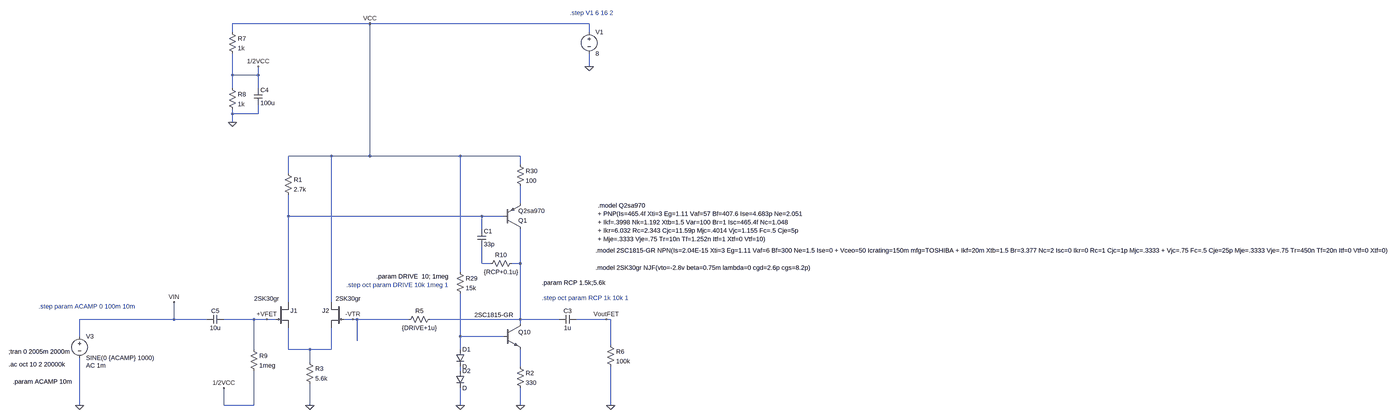
[diagram p0: schematic Discrete_OP_GainUp2.asc, whole sheet]
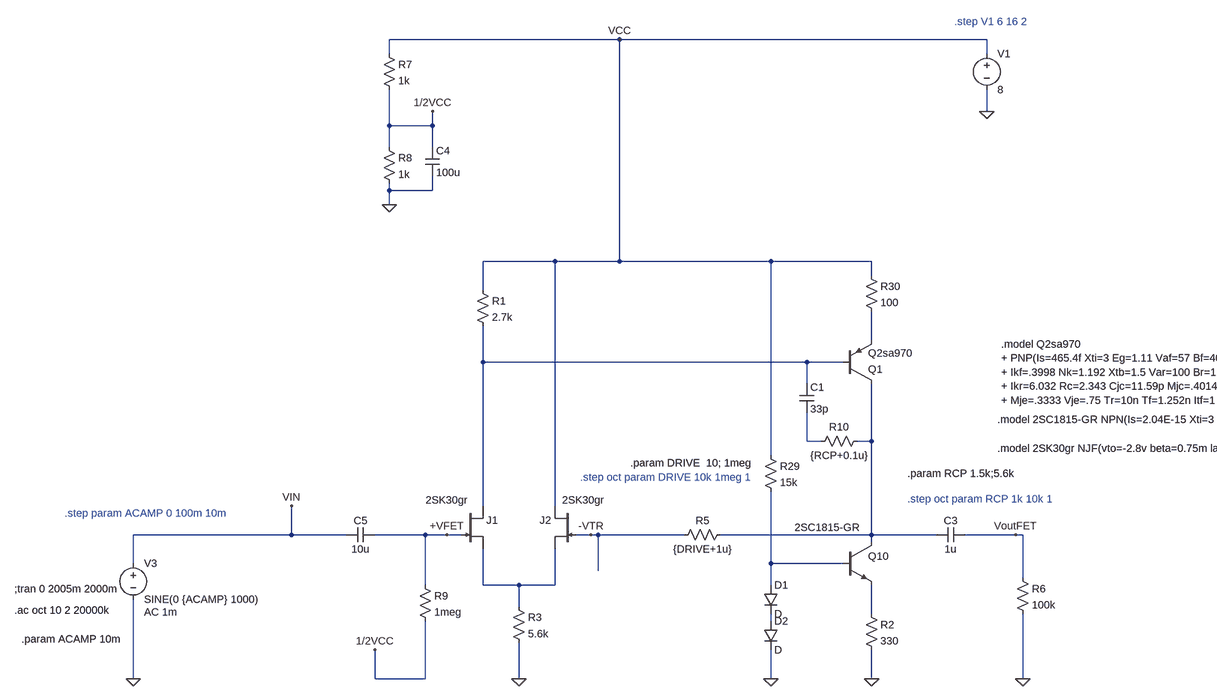
[diagram p1: schematic Discrete_OP_GainUp2.asc, part, row 1 of 1, column 1 of 2]
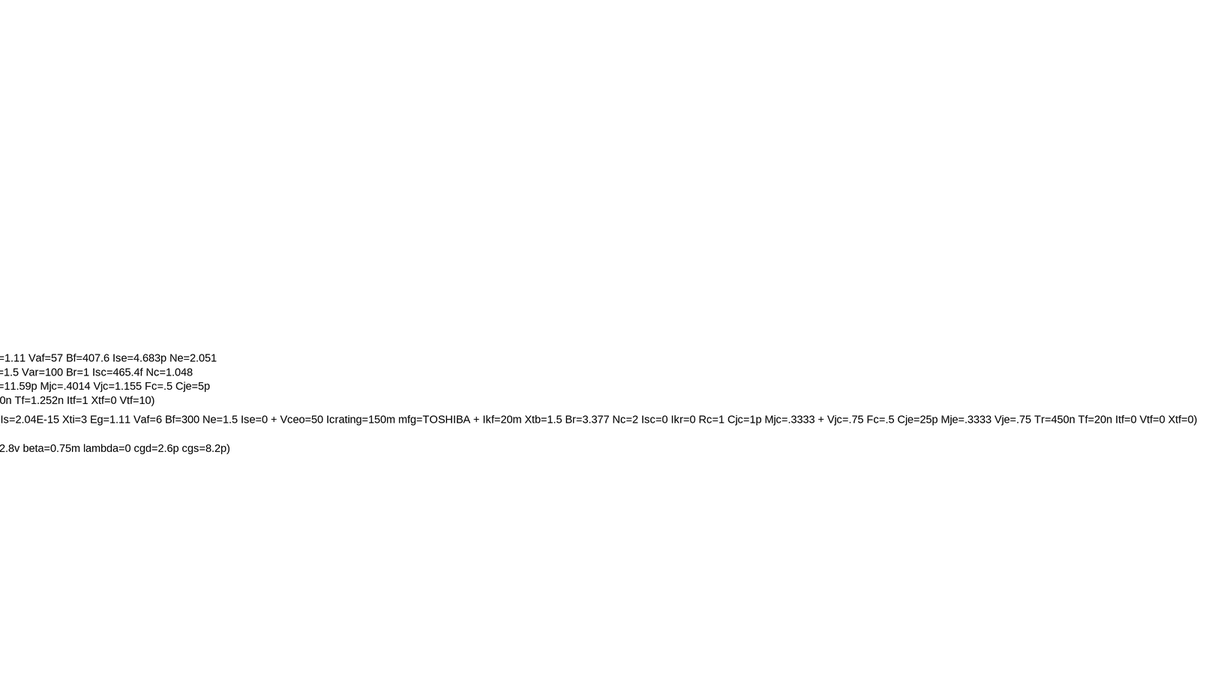
[diagram p2: schematic Discrete_OP_GainUp2.asc, part, row 1 of 1, column 2 of 2]
Discrete_OP_GainUp2.asc, the LTspice schematic file:
Version 4
SHEET 1 4864 4708
WIRE 608 -1136 96 -1136
WIRE 1424 -1136 608 -1136
WIRE 96 -1104 96 -1136
WIRE 1424 -1104 1424 -1136
WIRE 1424 -976 1424 -1024
WIRE 96 -944 96 -1024
WIRE 192 -944 192 -976
WIRE 192 -944 96 -944
WIRE 96 -896 96 -944
WIRE 192 -896 192 -944
WIRE 96 -800 96 -816
WIRE 192 -800 192 -832
WIRE 192 -800 96 -800
WIRE 96 -768 96 -800
WIRE 464 -624 304 -624
WIRE 608 -624 608 -1136
WIRE 608 -624 464 -624
WIRE 944 -624 608 -624
WIRE 1168 -624 944 -624
WIRE 1168 -592 1168 -624
WIRE 304 -560 304 -624
WIRE 1168 -448 1168 -512
WIRE 304 -400 304 -480
WIRE 1024 -400 304 -400
WIRE 1104 -400 1024 -400
WIRE 1024 -352 1024 -400
WIRE 1024 -224 1024 -288
WIRE 1056 -224 1024 -224
WIRE 1168 -224 1168 -352
WIRE 1168 -224 1136 -224
WIRE 944 -192 944 -624
WIRE 304 -80 304 -400
WIRE 464 -80 464 -624
WIRE -208 -16 -208 -80
WIRE -208 -16 -560 -16
WIRE 0 -16 -208 -16
WIRE 176 -16 64 -16
WIRE 224 -16 176 -16
WIRE 256 -16 224 -16
WIRE 544 -16 512 -16
WIRE 560 -16 544 -16
WIRE 752 -16 560 -16
WIRE 1168 -16 1168 -224
WIRE 1168 -16 832 -16
WIRE 1312 -16 1168 -16
WIRE 1488 -16 1376 -16
WIRE 1504 -16 1488 -16
WIRE 1168 0 1168 -16
WIRE -560 48 -560 -16
WIRE 944 48 944 -112
WIRE 1104 48 944 48
WIRE 560 64 560 -16
WIRE 1504 80 1504 -16
WIRE 176 96 176 -16
WIRE 304 96 304 16
WIRE 384 96 304 96
WIRE 464 96 464 16
WIRE 464 96 384 96
WIRE 944 96 944 48
WIRE 384 144 384 96
WIRE 1168 160 1168 96
WIRE 944 176 944 160
WIRE -560 304 -560 128
WIRE 64 304 64 240
WIRE 176 304 176 176
WIRE 176 304 64 304
WIRE 384 304 384 224
WIRE 944 304 944 240
WIRE 1168 304 1168 240
WIRE 1504 304 1504 160
FLAG -560 304 0
FLAG 384 304 0
FLAG 1168 304 0
FLAG 1504 304 0
FLAG 1424 -976 0
FLAG 1488 -16 VoutFET
FLAG 224 -16 +VFET
FLAG 608 -1136 VCC
FLAG 96 -768 0
FLAG 192 -976 1/2VCC
FLAG 64 240 1/2VCC
FLAG -208 -80 VIN
FLAG 544 -16 -VTR
FLAG 944 304 0
SYMBOL njf 256 -80 R0
WINDOW 3 -79 -13 Left 2
SYMATTR Value 2SK30gr
SYMATTR InstName J1
SYMBOL njf 512 -80 M0
WINDOW 3 -62 -13 Left 2
SYMATTR Value 2SK30gr
SYMATTR InstName J2
SYMBOL pnp 1104 -352 M180
SYMATTR InstName Q1
SYMATTR Value Q2sa970
SYMBOL res 288 -576 R0
SYMATTR InstName R1
SYMATTR Value 2.7k
SYMBOL res 1152 144 R0
SYMATTR InstName R2
SYMATTR Value 330
SYMBOL res 368 128 R0
SYMATTR InstName R3
SYMATTR Value 5.6k
SYMBOL voltage 1424 -1120 R0
WINDOW 123 0 0 Left 2
WINDOW 39 0 0 Left 2
SYMATTR InstName V1
SYMATTR Value 8
SYMBOL voltage -560 32 R0
WINDOW 123 24 124 Left 2
WINDOW 39 0 0 Left 2
SYMATTR Value2 AC 1m
SYMATTR InstName V3
SYMATTR Value SINE(0 {ACAMP} 1000)
SYMBOL res 1488 64 R0
SYMATTR InstName R6
SYMATTR Value 100k
SYMBOL cap 1376 -32 R90
WINDOW 0 0 32 VBottom 2
WINDOW 3 32 32 VTop 2
SYMATTR InstName C3
SYMATTR Value 1u
SYMBOL res 80 -1120 R0
SYMATTR InstName R7
SYMATTR Value 1k
SYMBOL res 80 -912 R0
SYMATTR InstName R8
SYMATTR Value 1k
SYMBOL cap 176 -896 R0
SYMATTR InstName C4
SYMATTR Value 100u
SYMBOL res 160 80 R0
SYMATTR InstName R9
SYMATTR Value 1meg
SYMBOL cap 64 -32 R90
WINDOW 0 0 32 VBottom 2
WINDOW 3 32 32 VTop 2
SYMATTR InstName C5
SYMATTR Value 10u
SYMBOL res 848 -32 R90
WINDOW 0 0 56 VBottom 2
WINDOW 3 32 56 VTop 2
SYMATTR InstName R5
SYMATTR Value {DRIVE+1u}
SYMBOL npn 1104 0 R0
WINDOW 3 -107 -32 Left 2
SYMATTR Value 2SC1815-GR
SYMATTR InstName Q10
SYMBOL diode 928 96 R0
SYMATTR InstName D1
SYMBOL diode 928 176 R0
SYMATTR InstName D2
SYMBOL res 928 -208 R0
SYMATTR InstName R29
SYMATTR Value 15k
SYMBOL res 1152 -608 R0
SYMATTR InstName R30
SYMATTR Value 100
SYMBOL cap 1008 -352 R0
SYMATTR InstName C1
SYMATTR Value 33p
SYMBOL res 1152 -240 R90
WINDOW 0 0 56 VBottom 2
WINDOW 3 32 56 VTop 2
SYMATTR InstName R10
SYMATTR Value {RCP+0.1u}
TEXT 1456 -440 Left 2 !.model Q2sa970 \n+ PNP(Is=465.4f Xti=3 Eg=1.11 Vaf=57 Bf=407.6 Ise=4.683p Ne=2.051\n+ Ikf=.3998 Nk=1.192 Xtb=1.5 Var=100 Br=1 Isc=465.4f Nc=1.048\n+ Ikr=6.032 Rc=2.343 Cjc=11.59p Mjc=.4014 Vjc=1.155 Fc=.5 Cje=5p\n+ Mje=.3333 Vje=.75 Tr=10n Tf=1.252n Itf=1 Xtf=0 Vtf=10)
TEXT -824 104 Left 2 !;tran 0 2005m 2000m
TEXT 1448 -208 Left 2 !.model 2SK30gr NJF(vto=-2.8v beta=0.75m lambda=0 cgd=2.6p cgs=8.2p)
TEXT 1352 -1176 Left 2 ;.step V1 6 16 2
TEXT -824 152 Left 2 !.ac oct 10 2 20000k
TEXT -808 216 Left 2 !.param ACAMP 10m
TEXT -712 -64 Left 2 ;.step param ACAMP 0 100m 10m
TEXT 1448 -272 Left 2 !.model 2SC1815-GR NPN(Is=2.04E-15 Xti=3 Eg=1.11 Vaf=6 Bf=300 Ne=1.5 Ise=0 + Vceo=50 Icrating=150m mfg=TOSHIBA + Ikf=20m Xtb=1.5 Br=3.377 Nc=2 Isc=0 Ikr=0 Rc=1 Cjc=1p Mjc=.3333 + Vjc=.75 Fc=.5 Cje=25p Mje=.3333 Vje=.75 Tr=450n Tf=20n Itf=0 Vtf=0 Xtf=0)
TEXT 632 -176 Left 2 !.param DRIVE  10; 1meg
TEXT 520 -144 Left 2 ;.step oct param DRIVE 10k 1meg 1
TEXT 1248 -152 Left 2 !.param RCP 1.5k;5.6k
TEXT 1248 -96 Left 2 ;.step oct param RCP 1k 10k 1

The netlist it stands for:
* Discrete_OP_GainUp2.asc
J1 N002 +VFET N006 2SK30gr
J2 VCC -VTR N006 2SK30gr
Q1 N004 N002 N001 0 Q2sa970
R1 VCC N002 2.7k
R2 N007 0 330
R3 N006 0 5.6k
V1 VCC 0 8
V3 VIN 0 SINE(0 {ACAMP} 1000) AC 1m
R6 VoutFET 0 100k
C3 VoutFET N004 1u
R7 VCC 1/2VCC 1k
R8 1/2VCC 0 1k
C4 1/2VCC 0 100u
R9 +VFET 1/2VCC 1meg
C5 +VFET VIN 10u
R5 N004 -VTR {DRIVE+1u}
Q10 N004 N005 N007 0 2SC1815-GR
D1 N005 N008 D
D2 N008 0 D
R29 VCC N005 15k
R30 VCC N001 100
C1 N002 N003 33p
R10 N004 N003 {RCP+0.1u}
.model D D
.lib standard.dio
.model NPN NPN
.model PNP PNP
.lib standard.bjt
.model NJF NJF
.model PJF PJF
.lib standard.jft
.model Q2sa970
+ PNP(Is=465.4f Xti=3 Eg=1.11 Vaf=57 Bf=407.6 Ise=4.683p Ne=2.051
+ Ikf=.3998 Nk=1.192 Xtb=1.5 Var=100 Br=1 Isc=465.4f Nc=1.048
+ Ikr=6.032 Rc=2.343 Cjc=11.59p Mjc=.4014 Vjc=1.155 Fc=.5 Cje=5p
+ Mje=.3333 Vje=.75 Tr=10n Tf=1.252n Itf=1 Xtf=0 Vtf=10)
;tran 0 2005m 2000m
.model 2SK30gr NJF(vto=-2.8v beta=0.75m lambda=0 cgd=2.6p cgs=8.2p)
* .step V1 6 16 2
.ac oct 10 2 20000k
.param ACAMP 10m
* .step param ACAMP 0 100m 10m
.model 2SC1815-GR NPN(Is=2.04E-15 Xti=3 Eg=1.11 Vaf=6 Bf=300 Ne=1.5 Ise=0 + Vceo=50 Icrating=150m mfg=TOSHIBA + Ikf=20m Xtb=1.5 Br=3.377 Nc=2 Isc=0 Ikr=0 Rc=1 Cjc=1p Mjc=.3333 + Vjc=.75 Fc=.5 Cje=25p Mje=.3333 Vje=.75 Tr=450n Tf=20n Itf=0 Vtf=0 Xtf=0)
.param DRIVE  10; 1meg
* .step oct param DRIVE 10k 1meg 1
.param RCP 1.5k;5.6k
* .step oct param RCP 1k 10k 1
.backanno
.end